# Altium schematic sheet LCmeter0-LCD-8pinlcd-PIC_COMP_1.SchDoc
size 355 x 148 mm
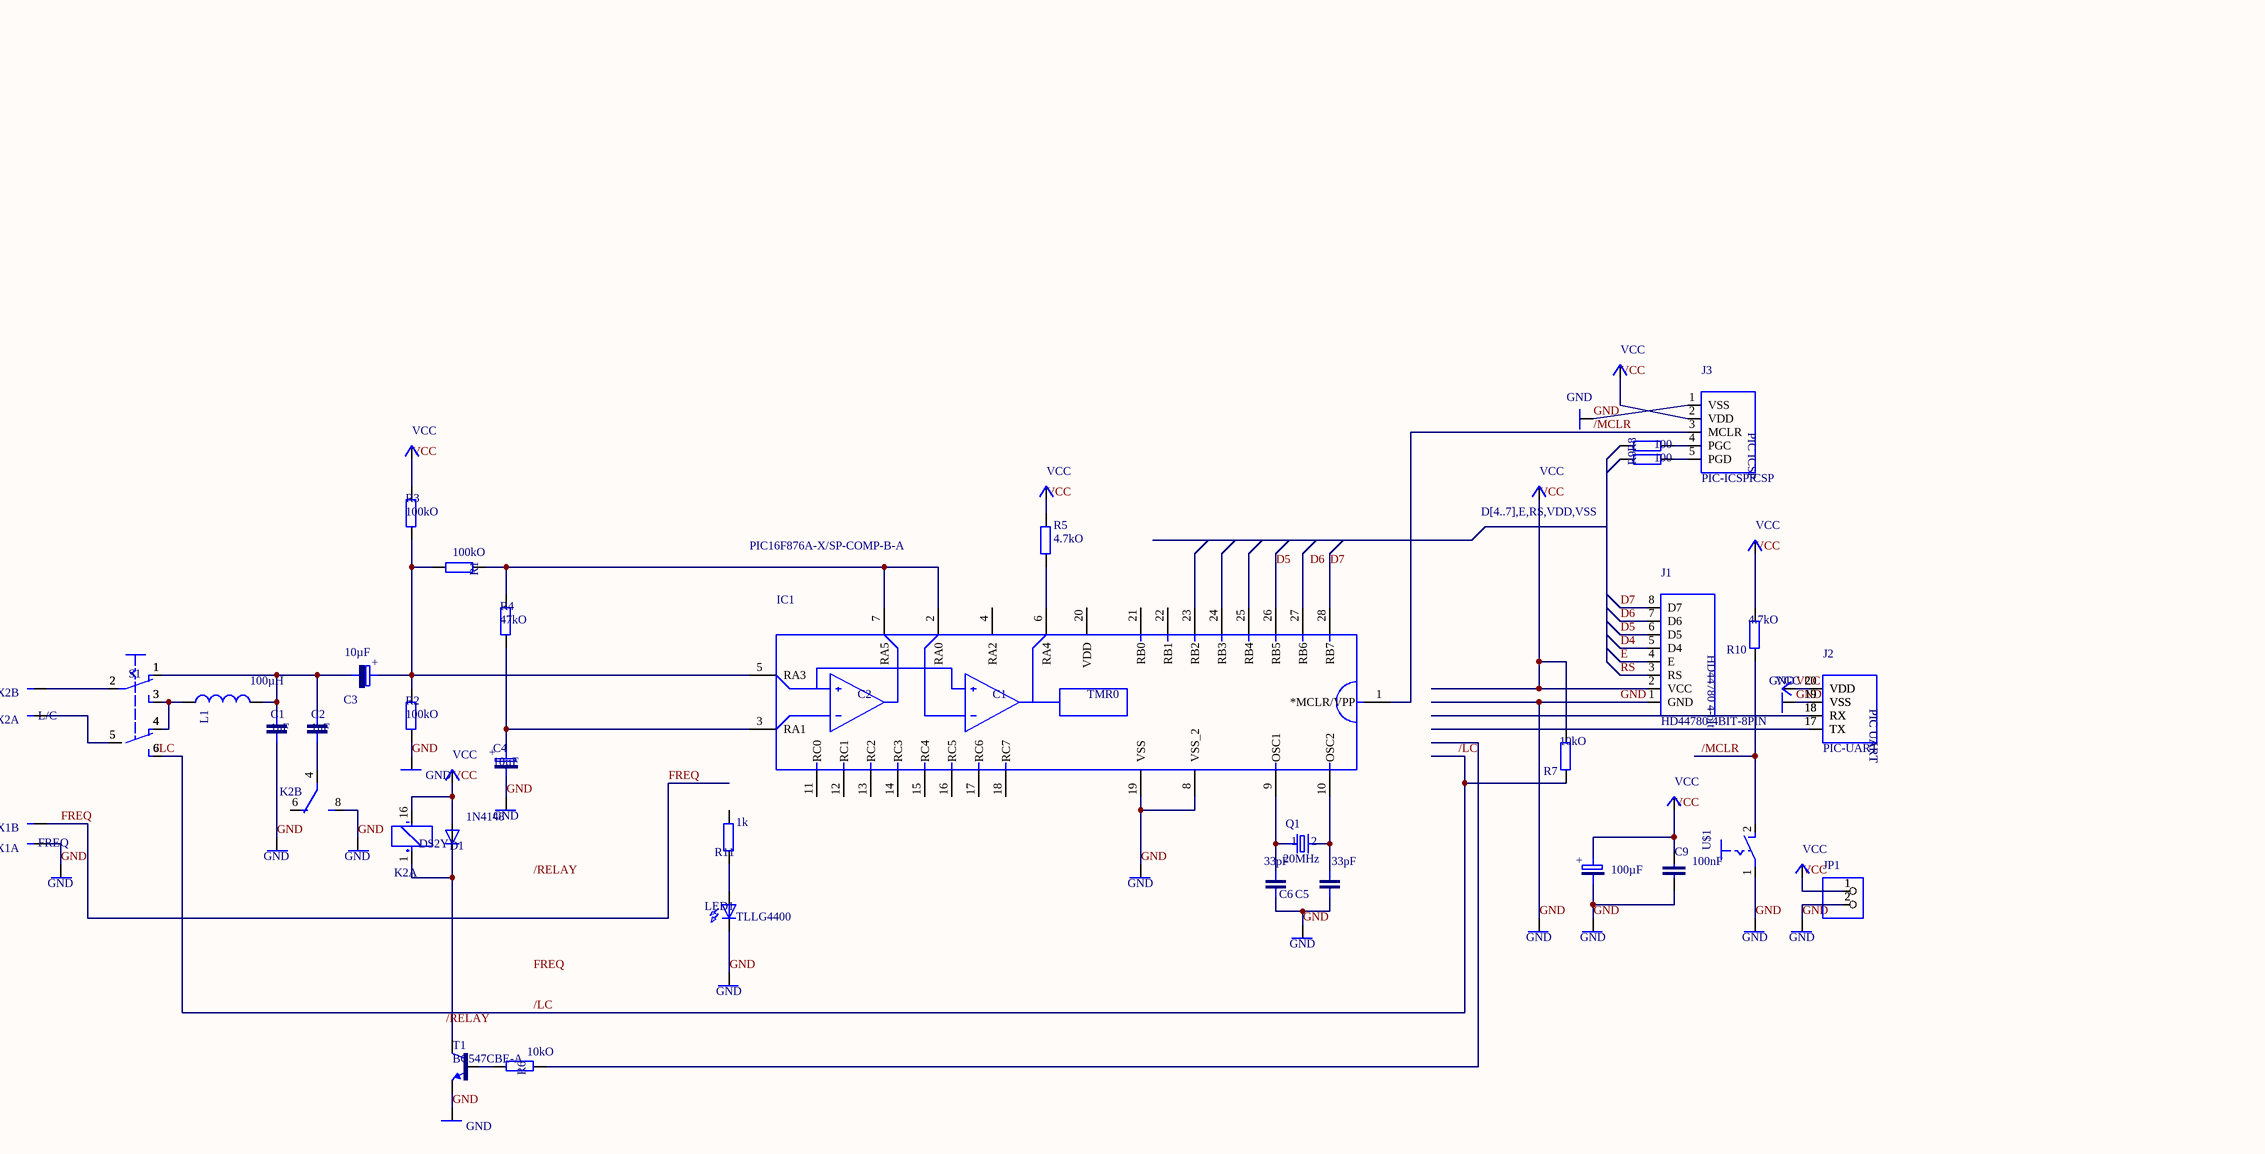
[diagram p0: LCmeter0-LCD-8pinlcd-PIC_COMP_1.SchDoc]

## Parts
C1  1nF  [C050-020X036]
C2  1nF  [C050-020X036]
C3  10µF  [E2,5-4]
C4  10µF  [E2,5-4]
C5  33pF  [C025-020X036]
C6  33pF  [C025-020X036]
C7  100µF  [E2,5-6]
C9  100nF  [C025-024X044]
D1  1N4148  [DO34-7]
GND1  GND
GND2  GND
GND3  GND
GND4  GND
GND5  GND
GND6  GND
GND7  GND
GND8  GND
GND9  GND
GND10  GND
GND11  GND
GND12  GND
GND13  GND
GND14  GND
GND15  GND
IC1  PIC16F876A-X/SP-COMP-B-A  [DIL28-3]
J1  HD44780-4BIT-8PIN  [CONN-8P]
J2  PIC-UART  [PIC-UART]
J3  PIC-ICSPICSP  [PIC-ICSP]
JP1  (no value)  [1X02]
K2  DS2Y  [DS2Y]  (parts A,B of 3)
L1  100µH  [L-02/5]
LED1  TLLG4400  [LED3MM]
P+1  VCC
P+2  VCC
P+3  VCC
P+4  VCC
P+5  VCC
P+6  VCC
P+7  VCC
P+8  VCC
P+9  VCC
Q1  20MHz  [HC49]
R1  100kO  [0202/7]
R2  100kO  [0202/7]
R3  100kO  [0202/7]
R4  47kO  [0202/7]
R5  4.7kO  [0202/7]
R6  10kO  [0202/7]
R7  10kO  [0202/10]
R8  100  [0202/5]
R9  100  [0202/5]
R10  4.7kO  [0202/7]
R11  1k  [0202/5]
S1  (no value)  [SLSW-2P2T]
T1  BC547CBE-A  [TO92-CBE-A]
U$1  (no value)  [PB-1P1T]
X1  FREQ  [70543-02]  (parts A,B of 2)
X2  L/C  [70543-02]  (parts A,B of 2)

## Nets
/LC: R7.1 S1.6(S1)
/MCLR: IC1.1(*MCLR/VPP) J3.3(MCLR) R10.1 U$1.2(S)
D4: J1.5(D4)
D5: IC1.26(RB5) J1.6(D5)
D6: J1.7(D6)
D7: IC1.28(RB7) J1.8(D7)
E: J1.4(E)
FREQ: X1.2(S)
GND: C1.2 C4.- C5.1 C6.1 C7.- C9.2 GND1.0(GND) GND2.0(GND) GND3.0(GND) GND4.0(GND) GND5.0(GND) GND6.0(GND) GND7.0(GND) GND8.0(GND) GND9.0(GND) GND10.0(GND) GND11.0(GND) GND12.0(GND) GND13.0(GND) GND14.0(GND) GND15.0(GND) IC1.8(VSS_2) IC1.19(VSS) J1.1(GND) J2.19(VSS) J3.1(VSS) JP1.2 K2.8(S) LED1.K(C) R2.2 T1.E U$1.1(P) X1.1(S)
RS: J1.3(RS)
VCC: C7.+ C9.1 D1.A J1.2(VCC) J2.17(TX) J2.20(VDD) J3.2(VDD) JP1.1 K2.16(-) P+1.0(VCC) P+2.0(VCC) P+3.0(VCC) P+4.0(VCC) P+5.0(VCC) P+6.0(VCC) P+7.0(VCC) P+8.0(VCC) P+9.0(VCC) R3.1 R5.1 R7.2 R10.2
NetC1_1: C1.1 C2.1 C3.- L1.2 S1.1(O)
NetC2_2: C2.2 K2.4(P)
NetC3_+: C3.+ IC1.5(RA3) R1.2 R2.1 R3.2
NetC4_+: C4.+ IC1.3(RA1) R4.2
NetC5_2: C5.2 IC1.10(OSC2) Q1.2
NetC6_2: C6.2 IC1.9(OSC1) Q1.1
NetD1_C: D1.C K2.1(+) T1.C
NetIC1_2: IC1.2(RA0) IC1.7(RA5) R1.1 R4.1
NetIC1_6: IC1.6(RA4) R5.2
NetJ3_4: J3.4(PGC) R8.2
NetJ3_5: J3.5(PGD) R9.2
NetL1_1: L1.1 S1.3(S) S1.4(O1)
NetLED1_A: LED1.A R11.1
NetR6_1: R6.1 T1.B
NetS1_2: S1.2(P) X2.2(S)
NetS1_5: S1.5(P1) X2.1(S)

Not connected (* = marked no-connect by the designer): IC1 4(RA2) 11(RC0) 12(RC1) 13(RC2) 14(RC3) 15(RC4) 16(RC5) 17(RC6) 18(RC7) 20(VDD) 21(RB0) 22(RB1) 23(RB2) 24(RB3) 25(RB4) 27(RB6); J2 18(RX); K2 6(O); R6 2; R8 1; R9 1; R11 2

## Notes on the sheet
- (near P+6) D[4..7],E,RS,VDD,VSS
- Labels drawn without touching a wire or pin: /LC, /RELAY, D6, FREQ
- (in symbol HD44780-4BIT-8PIN) HD44780 4-bit
- (in symbol PIC16F876A-X/SP-COMP-B-A) C2; C1; TMR0
- (in symbol PIC-ICSPICSP) PIC ICSP
- (in symbol PIC-UART) PIC UART

## Library data of the parts
C1 C2 = C050-020X036
C3 C4 = CPOLE2,5-4
C5 C6 = C025-020X036
C7 = CPOLE2.5-6
C9 = C-EU025-024X044
D1 = 1N414834-7
JP1 = PINHD-1X2
K2 = DS2Y-S-DC5V
L1 = L02/5
Q1 = CRYSTALHC49
R1-R6 R10 = R0202/7
R7 = R0202/10
R8 R9 R11 = R0202/5
S1 = SL-SW-2P-2T
U$1 = PB-1P-1T
X1 X2 = C-GRID-02-70543